# Altium schematic sheet Telemetry.SchDoc
size A
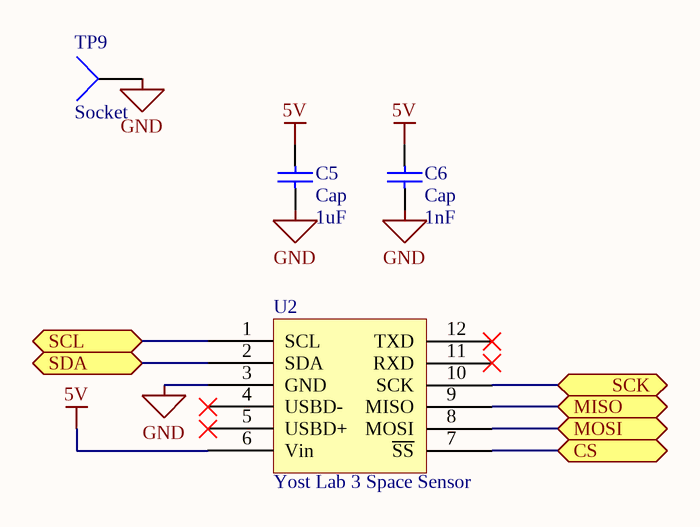
[diagram p0: Telemetry.SchDoc]

## Parts
C5  Cap  value 1uF  [RESC3116X65N]
C6  Cap  value 1nF  [0402]
TP9  Socket  [5006]
U2  Yost Lab 3 Space Sensor  [Yost 3 Space Sensor]

## Ports
CS, MISO, MOSI, SCK, SCL, SDA

## Nets
5V: C5.2 C6.2 U2.6(Vin)
GND: C5.1 C6.1 TP9.1 U2.3(GND)
CS: U2.7(~{SS}) ; port CS
MISO: U2.9(MISO) ; port MISO
MOSI: U2.8(MOSI) ; port MOSI
SCK: U2.10(SCK) ; port SCK
SCL: U2.1(SCL) ; port SCL
SDA: U2.2(SDA) ; port SDA

Not connected (* = marked no-connect by the designer): U2 4(USBD-)* 5(USBD+)* 11(RXD)* 12(TXD)*

## Library data of the parts
C5 = Cap: Capacitor; Manufacturer Part Number: CL31B105KCHNNNE; Vendor Part Number: 1276-1838-1-ND
C6 = Cap: Capacitor; Manufacturer Part Number: GRM155R72A102KA01D; Vendor Part Number: 490-6366-1-ND
TP9 = Socket: Vendor Part Number: 36-5006-ND; LatestRevisionDate: 17-Jul-2002; LatestRevisionNote: Re-released for DXP Platform.; Publisher: Altium Limited; Manufacturer Part Number: 5006
U2 = Yost Lab 3 Space Sensor: Manufacturer Part Number: Yost Lab 3 Space Sensor